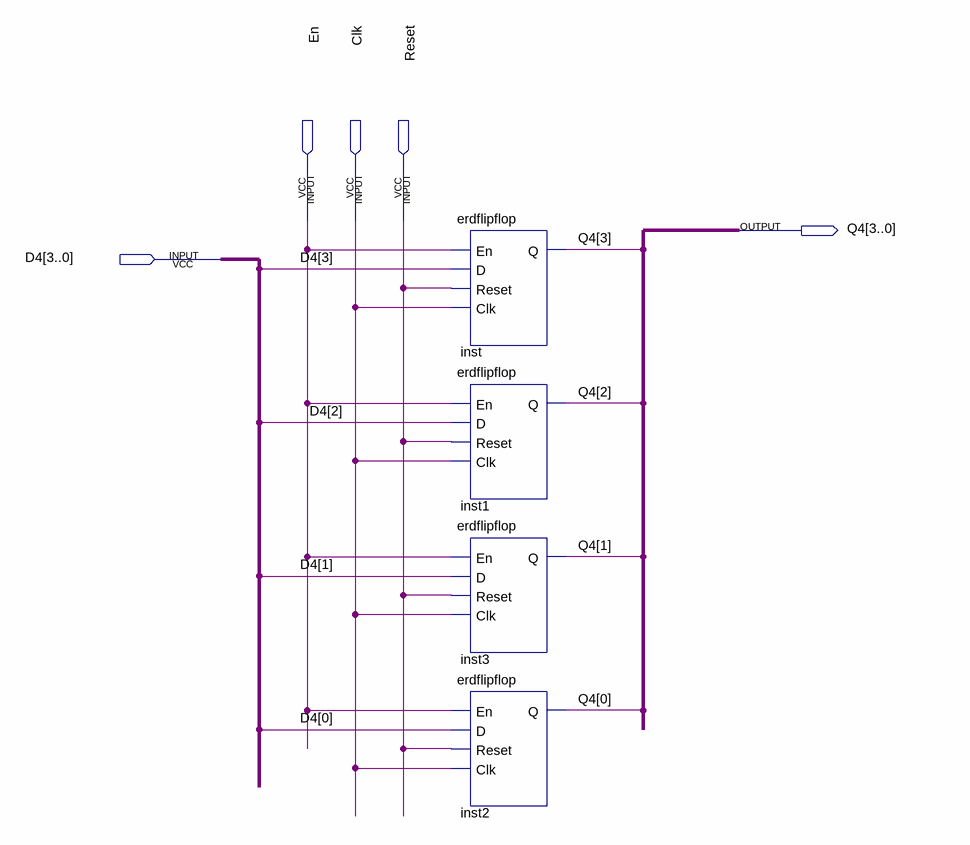
[diagram p0: schematic sheet]
// Quartus schematic erdregister4.bdf as structural Verilog: 4 symbols, 5 pins
module erdregister4 (
  input  En,
  input  Clk,
  input  Reset,
  input  [3:0] D4,
  output [3:0] Q4
);

  erdflipflop inst (.En(En), .D(D4[3]), .Reset(Reset), .Clk(Clk), .Q(Q4[3]));
  erdflipflop inst1 (.En(En), .D(D4[2]), .Reset(Reset), .Clk(Clk), .Q(Q4[2]));
  erdflipflop inst3 (.En(En), .D(D4[1]), .Reset(Reset), .Clk(Clk), .Q(Q4[1]));
  erdflipflop inst2 (.En(En), .D(D4[0]), .Reset(Reset), .Clk(Clk), .Q(Q4[0]));
endmodule
